# Altium schematic sheet WiFiChessSch.SchDoc
size A1
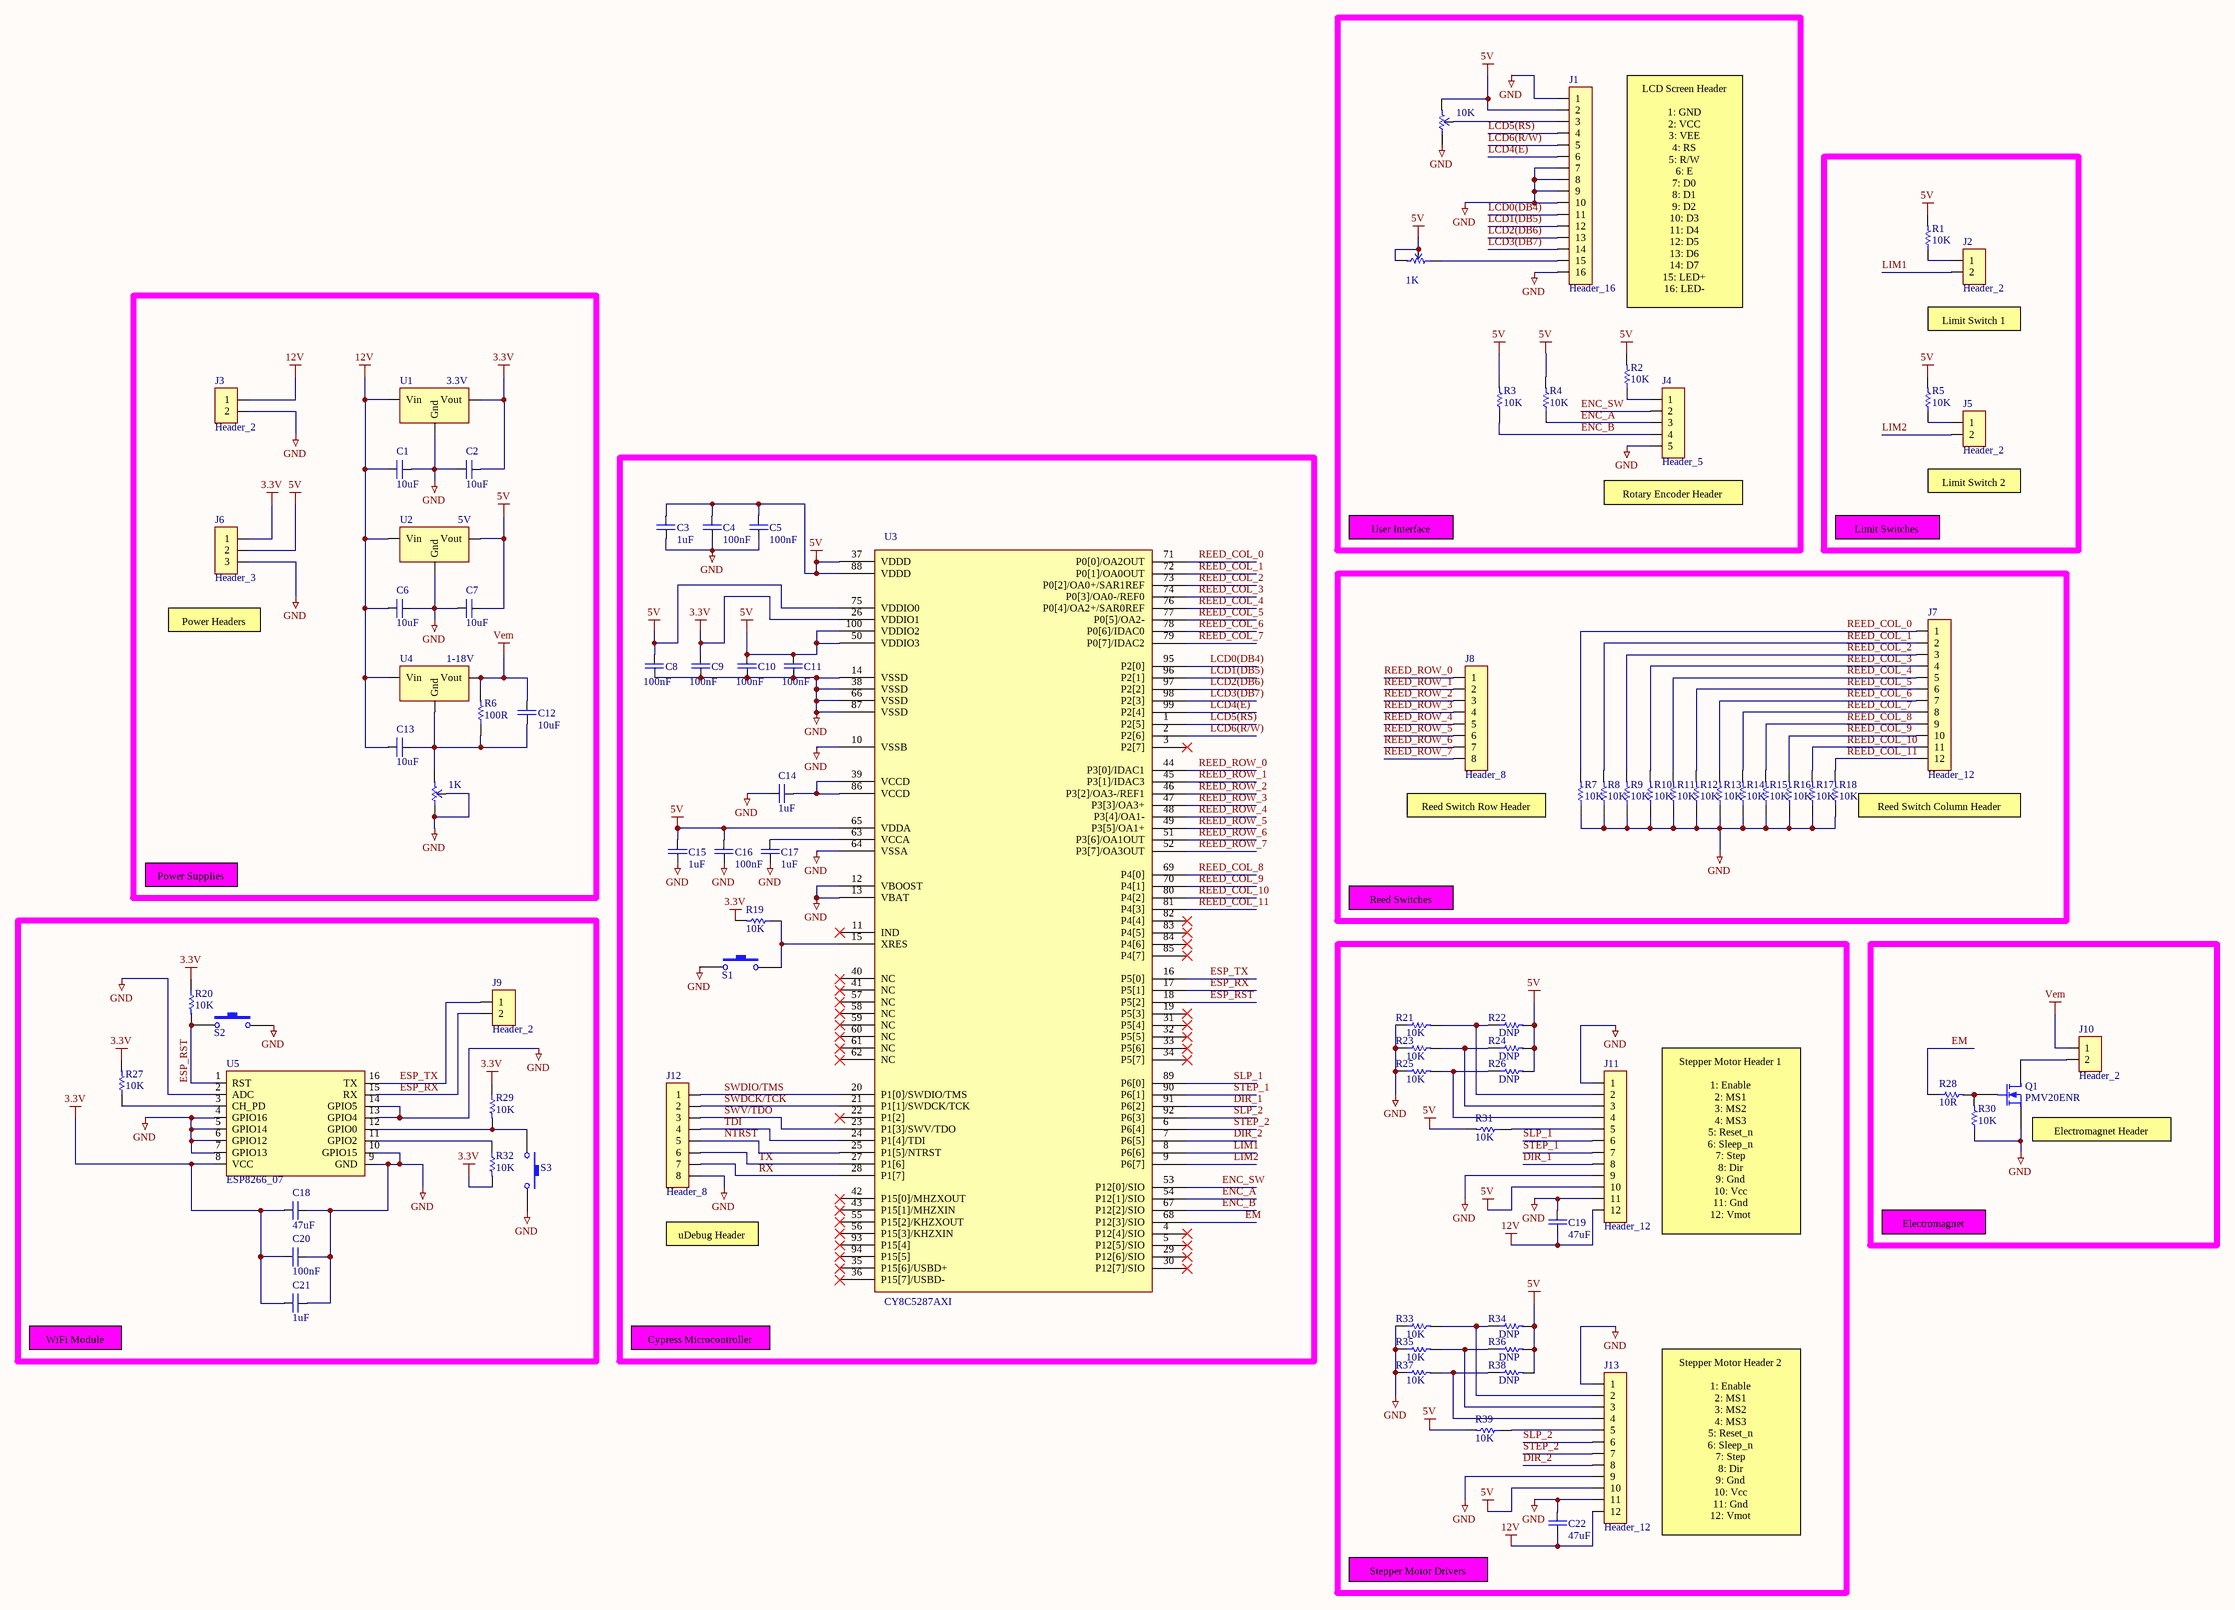
[diagram p0: WiFiChessSch.SchDoc]

## Parts
C1  10uF  [CAP0603]
C2  10uF  [CAP0603]
C3  1uF  [CAP0603]
C4  100nF  [CAP0603]
C5  100nF  [CAP0603]
C6  10uF  [CAP0603]
C7  10uF  [CAP0603]
C8  100nF  [CAP0603]
C9  100nF  [CAP0603]
C10  100nF  [CAP0603]
C11  100nF  [CAP0603]
C12  10uF  [CAP0603]
C13  10uF  [CAP0603]
C14  1uF  [CAP0603]
C15  1uF  [CAP0603]
C16  100nF  [CAP0603]
C17  1uF  [CAP0603]
C18  47uF  [CAP_EL_8x5.9]
C19  47uF  [CAP_EL_8x5.9]
C20  100nF  [CAP0603]
C21  1uF  [CAP0603]
C22  47uF  [CAP_EL_8x5.9]
J1  Header_16  [16 Pin Header 2.54mm]
J2  Header_2  [2 Pin Header 2.54mm]
J3  Header_2  [2 Pin Header 2.54mm]
J4  Header_5  [5 Pin Header 2.54mm]
J5  Header_2  [2 Pin Header 2.54mm]
J6  Header_3  [3 Pin Header 2.54mm]
J7  Header_12  [12 Pin Header 2.54mm]
J8  Header_8  [8 Pin Header 2.54mm]
J9  Header_2  [2 Pin Header 2.54mm]
J10  Header_2  [2 Pin Header 2.54mm]
J11  Header_12  [12 Pin Header 2.54mm]
J12  Header_8  [8 Pin Header 2.54mm]
J13  Header_12  [12 Pin Header 2.54mm]
Q1  PMV20ENR  [SOT23]
R1  10K  [RES0603]
R2  10K  [RES0603]
R3  10K  [RES0603]
R4  10K  [RES0603]
R5  10K  [RES0603]
R6  100R  [RES0603]
R7  10K  [RES0603]
R8  10K  [RES0603]
R9  10K  [RES0603]
R10  10K  [RES0603]
R11  10K  [RES0603]
R12  10K  [RES0603]
R13  10K  [RES0603]
R14  10K  [RES0603]
R15  10K  [RES0603]
R16  10K  [RES0603]
R17  10K  [RES0603]
R18  10K  [RES0603]
R19  10K  [RES0603]
R20  10K  [RES0603]
R21  10K  [RES0603]
R22  DNP  [RES0603]
R23  10K  [RES0603]
R24  DNP  [RES0603]
R25  10K  [RES0603]
R26  DNP  [RES0603]
R27  10K  [RES0603]
R28  10R  [RES0603]
R29  10K  [RES0603]
R30  10K  [RES0603]
R31  10K  [RES0603]
R32  10K  [RES0603]
R33  10K  [RES0603]
R34  DNP  [RES0603]
R35  10K  [RES0603]
R36  DNP  [RES0603]
R37  10K  [RES0603]
R38  DNP  [RES0603]
R39  10K  [RES0603]
S1  NO-Tactile Switch  [FSM2JSMAATR]  (value not drawn)
S2  NO-Tactile Switch  [FSM2JSMAATR]  (value not drawn)
S3  NO-Tactile Switch  [FSM2JSMAATR]  (value not drawn)
U1  3.3V  [SOT223]
U2  5V  [SOT223]
U3  CY8C5287AXI  [TQPF-100]
U4  1-18V  [SOT223]
U5  ESP8266_07  [ESP-07]
VR1  10K  [RESPVZ3A]
VR2  1K  [RESPVZ3A]
VR3  1K  [RESPVZ3A]

## Nets
3.3V: C2.2 C9.2 C18.1 C20.2 C21.2 J6.1 R19.2 R20.1 R27.2 R29.1 R32.2 U1.2(Vout) U3.26(VDDIO1) U5.8(VCC)
5V: C3.2 C4.2 C5.2 C7.2 C8.2 C10.2 C11.2 C15.2 C16.2 J1.2 J6.2 J11.10 J13.10 R1.2 R2.2 R3.2 R4.2 R5.2 R22.2 R24.2 R26.2 R31.2 R34.2 R36.2 R38.2 R39.2 U2.2(Vout) U3.37(VDDD) U3.50(VDDIO3) U3.65(VDDA) U3.75(VDDIO0) U3.88(VDDD) U3.100(VDDIO2) VR1.1 VR2.1 VR2.2
12V: C1.1 C6.1 C13.1 C19.1 C22.1 J3.1 J11.12 J13.12 U1.3(Vin) U2.3(Vin) U4.3(Vin)
GND: C1.2 C2.1 C3.1 C4.1 C5.1 C6.2 C7.1 C8.1 C9.1 C10.1 C11.1 C14.1 C15.1 C16.1 C17.1 C18.2 C19.2 C20.1 C21.1 C22.2 J1.1 J1.7 J1.8 J1.9 J1.10 J1.16 J3.2 J4.5 J6.3 J11.1 J11.9 J11.11 J12.8 J13.1 J13.9 J13.11 Q1.3(D) R7.1 R8.1 R9.1 R10.1 R11.1 R12.1 R13.1 R14.1 R15.1 R16.1 R17.1 R18.1 R21.1 R23.1 R25.1 R30.1 R33.1 R35.1 R37.1 S1.1 S2.2 S3.2 U1.1(Gnd) U2.1(Gnd) U3.10(VSSB) U3.12(VBOOST) U3.13(VBAT) U3.14(VSSD) U3.38(VSSD) U3.64(VSSA) U3.66(VSSD) U3.87(VSSD) U5.2(ADC) U5.4(GPIO16) U5.5(GPIO14) U5.6(GPIO12) U5.7(GPIO13) U5.9(GND) U5.10(GPIO15) U5.13(GPIO4) U5.14(GPIO5) VR1.3 VR3.2 VR3.3
Vem: C12.2 J10.1 R6.2 U4.2(Vout)
DIR_1: J11.8 U3.91(P6[2])
DIR_2: J13.8 U3.7(P6[5])
EM: R28.1 U3.68(P12[3]/SIO)
ENC_A: J4.3 R4.1 U3.54(P12[1]/SIO)
ENC_B: J4.4 R3.1 U3.67(P12[2]/SIO)
ENC_SW: J4.2 U3.53(P12[0]/SIO)
ESP_RST: R20.2 S2.1 U3.18(P5[2]) U5.1(RST)
ESP_RX: J9.2 U3.17(P5[1]) U5.15(RX)
ESP_TX: J9.1 U3.16(P5[0]) U5.16(TX)
LCD0(DB4): J1.11 U3.95(P2[0])
LCD1(DB5): J1.12 U3.96(P2[1])
LCD2(DB6): J1.13 U3.97(P2[2])
LCD3(DB7): J1.14 U3.98(P2[3])
LCD4(E): J1.6 U3.99(P2[4])
LCD5(RS): J1.4 U3.1(P2[5])
LCD6(R/W): J1.5 U3.2(P2[6])
LIM1: J2.2 U3.8(P6[6])
LIM2: J5.2 U3.9(P6[7])
NTRST: J12.5 U3.25(P1[5]/NTRST)
REED_COL_0: J7.1 R7.2 U3.71(P0[0]/OA2OUT)
REED_COL_1: J7.2 R8.2 U3.72(P0[1]/OA0OUT)
REED_COL_2: J7.3 R9.2 U3.73(P0[2]/OA0+/SAR1REF)
REED_COL_3: J7.4 R10.2 U3.74(P0[3]/OA0-/REF0)
REED_COL_4: J7.5 R11.2 U3.76(P0[4]/OA2+/SAR0REF)
REED_COL_5: J7.6 R12.2 U3.77(P0[5]/OA2-)
REED_COL_6: J7.7 R13.2 U3.78(P0[6]/IDAC0)
REED_COL_7: J7.8 R14.2 U3.79(P0[7]/IDAC2)
REED_COL_8: J7.9 R15.2 U3.69(P4[0])
REED_COL_9: J7.10 R16.2 U3.70(P4[1])
REED_COL_10: J7.11 R17.2 U3.80(P4[2])
REED_COL_11: J7.12 R18.2 U3.81(P4[3])
REED_ROW_0: J8.1 U3.44(P3[0]/IDAC1)
REED_ROW_1: J8.2 U3.45(P3[1]/IDAC3)
REED_ROW_2: J8.3 U3.46(P3[2]/OA3-/REF1)
REED_ROW_3: J8.4 U3.47(P3[3]/OA3+)
REED_ROW_4: J8.5 U3.48(P3[4]/OA1-)
REED_ROW_5: J8.6 U3.49(P3[5]/OA1+)
REED_ROW_6: J8.7 U3.51(P3[6]/OA1OUT)
REED_ROW_7: J8.8 U3.52(P3[7]/OA3OUT)
RX: J12.7 U3.28(P1[7])
SLP_1: J11.6 U3.89(P6[0])
SLP_2: J13.6 U3.92(P6[3])
STEP_1: J11.7 U3.90(P6[1])
STEP_2: J13.7 U3.6(P6[4])
SWDCK/TCK: J12.2 U3.21(P1[1]/SWDCK/TCK)
SWDIO/TMS: J12.1 U3.20(P1[0]/SWDIO/TMS)
SWV/TDO: J12.3 U3.23(P1[3]/SWV/TDO)
TDI: J12.4 U3.24(P1[4]/TDI)
TX: J12.6 U3.27(P1[6])
NetC12_1: C12.1 C13.2 R6.1 U4.1(Gnd) VR3.1
NetC14_2: C14.2 U3.39(VCCD) U3.86(VCCD)
NetC17_2: C17.2 U3.63(VCCA)
NetJ1_3: J1.3 VR1.2
NetJ1_15: J1.15 VR2.3
NetJ2_1: J2.1 R1.1
NetJ4_1: J4.1 R2.1
NetJ5_1: J5.1 R5.1
NetJ10_2: J10.2 Q1.1(G)
NetJ11_2: J11.2 R21.2 R22.1
NetJ11_3: J11.3 R23.2 R24.1
NetJ11_4: J11.4 R25.2 R26.1
NetJ11_5: J11.5 R31.1
NetJ13_2: J13.2 R33.2 R34.1
NetJ13_3: J13.3 R35.2 R36.1
NetJ13_4: J13.4 R37.2 R38.1
NetJ13_5: J13.5 R39.1
NetQ1_2: Q1.2(S) R28.2 R30.2
NetR19_1: R19.1 S1.2 U3.15(XRES)
NetR27_1: R27.1 U5.3(CH_PD)
NetR29_2: R29.2 S3.1 U5.12(GPIO0)
NetR32_1: R32.1 U5.11(GPIO2)

Not connected (* = marked no-connect by the designer): U3 3(P2[7])* 4(P12[4]/SIO)* 5(P12[5]/SIO)* 11(IND)* 19(P5[3])* 22(P1[2])* 29(P12[6]/SIO)* 30(P12[7]/SIO)* 31(P5[4])* 32(P5[5])* 33(P5[6])* 34(P5[7])* 35(P15[6]/USBD+)* 36(P15[7]/USBD-)* 40(NC)* 41(NC)* 42(P15[0]/MHZXOUT)* 43(P15[1]/MHZXIN)* 55(P15[2]/KHZXOUT)* 56(P15[3]/KHZXIN)* 57(NC)* 58(NC)* 59(NC)* 60(NC)* 61(NC)* 62(NC)* 82(P4[4])* 83(P4[5])* 84(P4[6])* 85(P4[7])* 93(P15[4])* 94(P15[5])*

## Notes on the sheet
- LCD Screen Header
  1: GND
  2: VCC
  3: VEE
  4: RS
  5: R/W
  6: E
  7: D0
  8: D1
  9: D2
  10: D3
  11: D4
  12: D5
  13: D6
  14: D7
  15: LED+
  16: LED-
- (near J2) Limit Switch 1
- User Interface
- (near J4) Rotary Encoder Header
- Limit Switches
- (near J5) Limit Switch 2
- (near J6) Power Headers
- Reed Switch Row Header
- Reed Switch Column Header
- Power Supplies
- Reed Switches
- (near Q1) Electromagnet Header
- (near J12) uDebug Header
- Stepper Motor Header 1
  1: Enable
  2: MS1
  3: MS2
  4: MS3
  5: Reset_n
  6: Sleep_n
  7: Step
  8: Dir
  9: Gnd
  10: Vcc
  11: Gnd
  12: Vmot
- Electromagnet
- WiFi Module
- Cypress Microcontroller
- Stepper Motor Header 2
  1: Enable
  2: MS1
  3: MS2
  4: MS3
  5: Reset_n
  6: Sleep_n
  7: Step
  8: Dir
  9: Gnd
  10: Vcc
  11: Gnd
  12: Vmot
- Stepper Motor Drivers

## Library data of the parts
C1 C2 C6 C7 C12 C13 = Cap_10uF_0603: Value: 10uF
C3 C14 C15 C17 C21 = Cap_1uF_0603: Value: 1uF
C4 C5 C8-C11 C16 C20 = Cap_100nF_0603: Value: 100nF
C18 C19 C22 = Cap_47uF_Alu: Manufacturer: Nichicon; Part Number: UWT1E470MCL6GS; Value: 47uF
J1 = Header_16: 16 pin header
J2 J3 J5 J9 J10 = Header_2: 2 Pin Header
J4 = Header_5: 5 Pin Header
J6 = Header_3: 3 Pin Header
J7 J11 J13 = Header_12: 12 Pin Header
J8 J12 = Header_8: 8 Pin Header
Q1 = PMV20ENR: Logic Level P-FET; Manufacturer: NXP Semiconductor; Part Number: PMV20ENR
R1-R5 R7-R21 R23 R25 R27 R29-R33 R35 R37 R39 = Res_10K_0603: Resistor; Part Number: RC0603JR-0710KL; Manufacturer: Yageo; Tolerance: 5%; Value: 10K
R6 = Res_100R_0603_1: Resistor; Tolerance: 5%; Value: 100R
R22 R24 R26 R34 R36 R38 = Res_0603_DNP: Resistor; Tolerance: 5%; Value: DNP
R28 = Res_10R_0603: Resistor; Tolerance: 5%; Value: 10R
S1-S3 = NO-Tactile Switch: Switch; Part Number: PTS645SK50SMTR92 LFS; Manufacturer: C&K Components
U1 = NCP1117ST33T3G: 3.3V_800mA_Linear; Manufacturer: ON Semiconductor; Part Number: NCP1117ST33T3G
U2 = NCV1117ST50T3G: 5V_1A_Linear; Manufacturer: ON Semiconductor; Part Number: NCV1117ST50T3G
U3 = CY8C5287AXI: Cypress CY8C52 PSoC 5; Part Number: CY8C5287AXI-LP095; Manufacturer: Cypress Semiconductor
U4 = NCV1117STAT3G: Adj_1A_Linear; Manufacturer: ON Semiconductor; Part Number: NCV1117STAT3G
U5 = ESP8266_07: ESP-07 WiFi Module
VR1 = PVZ3A_10K_Trimmer_Pot: Part Number: PVZ3A103C01R00; Manufacturer: Murata Electronics; Value: 10K
VR2 VR3 = PVZ3A_1K_Trimmer_Pot: Part Number: PVZ3A102C01R00; Manufacturer: Murata Electronics; Value: 1K